# Altium schematic sheet DDR4.SchDoc: DDR4
size B; DocumentNumber: 2; SheetNumber: 2; SheetTotal: 46
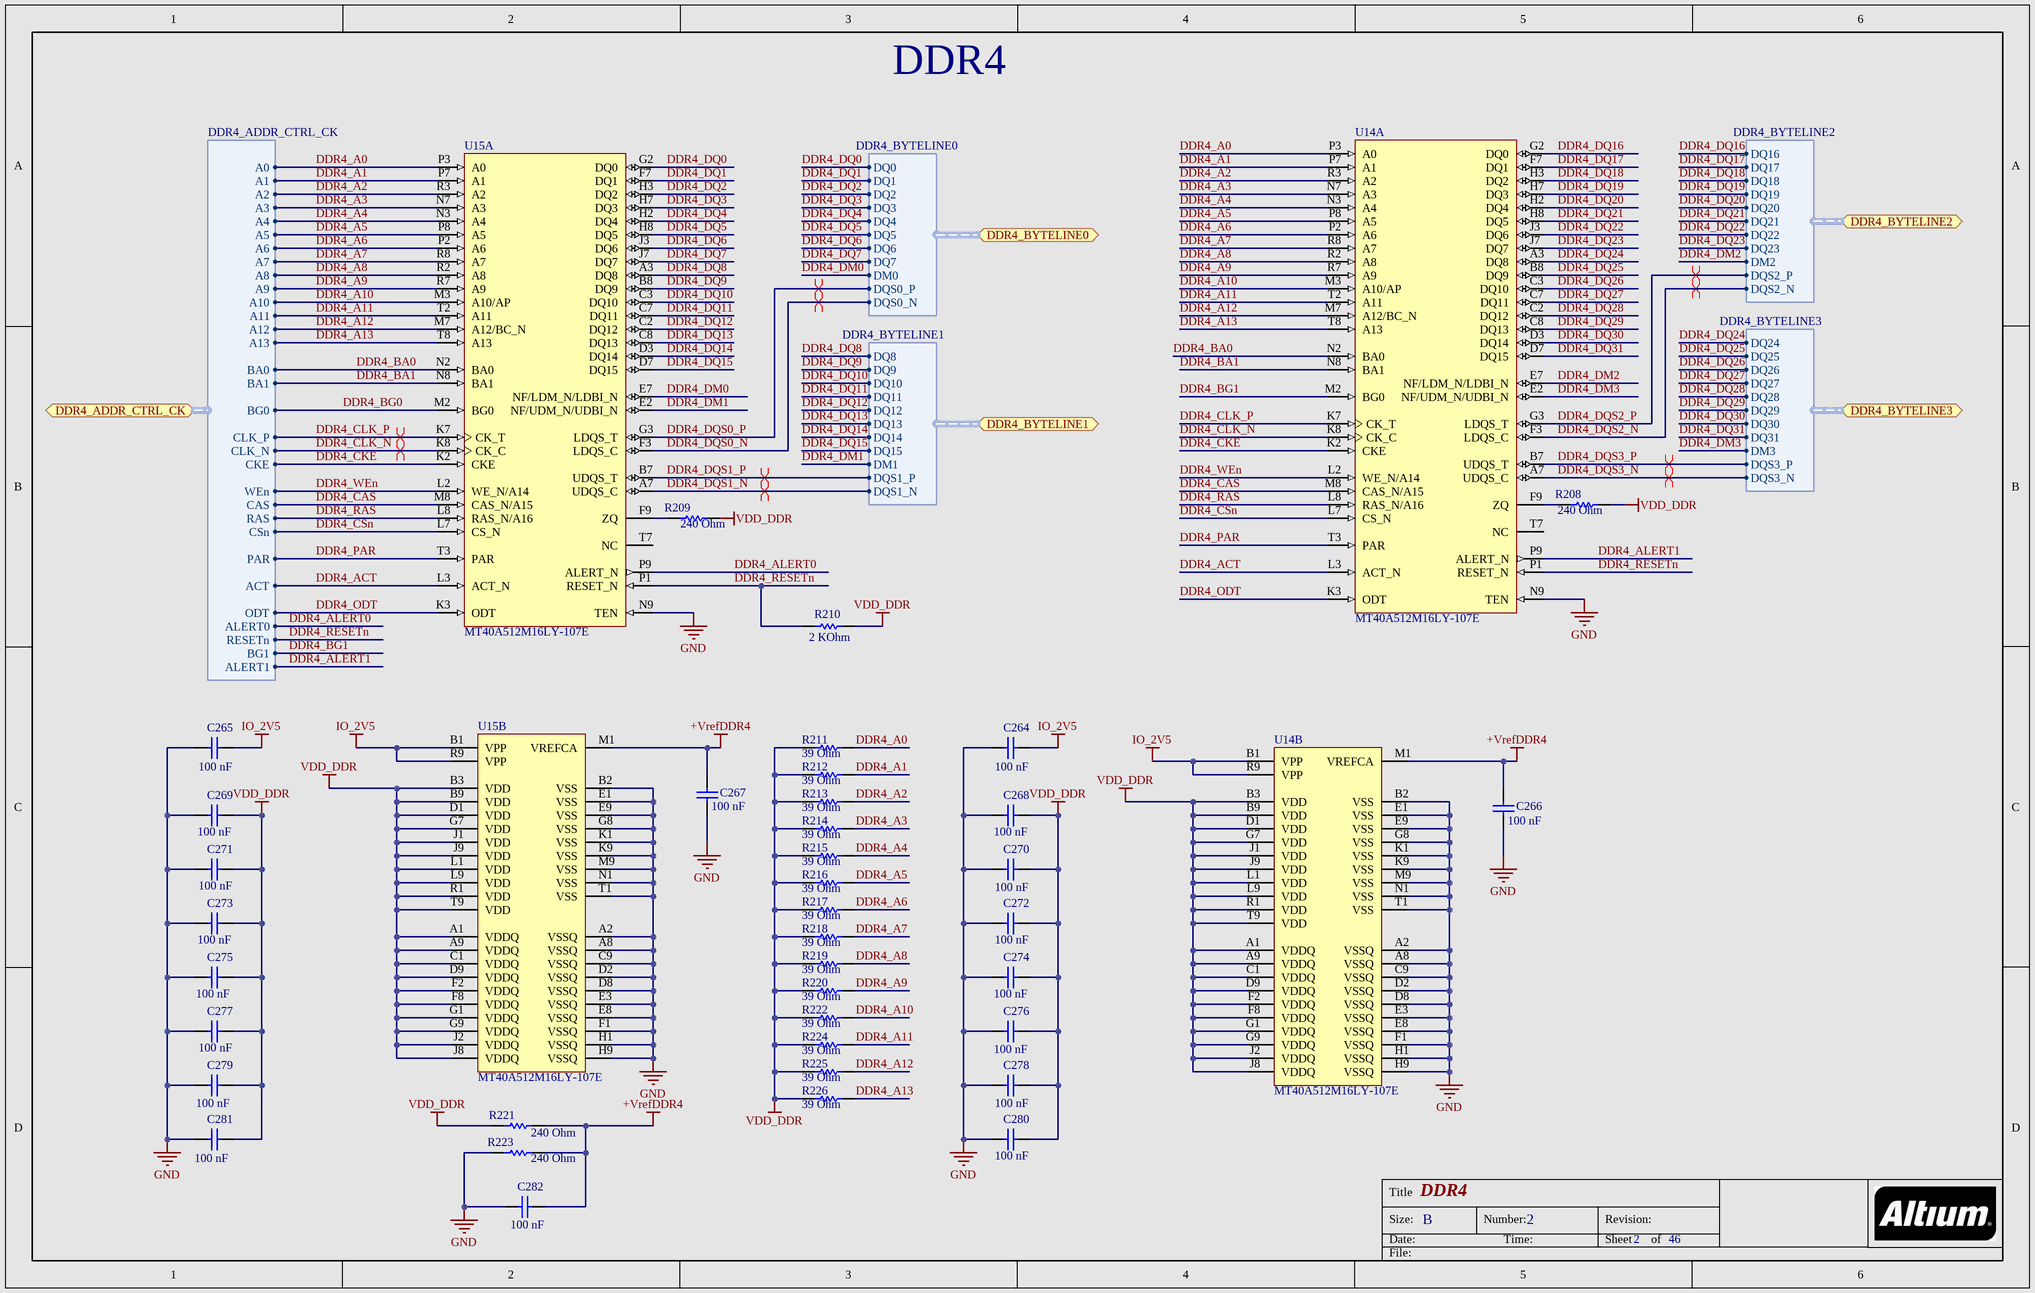
[diagram p0: DDR4.SchDoc]

## Parts
C264  Capacitance: 100 nF  [CAPC0603X33X15LL03T05]  (hidden comment: GRM033R60J104KE19D)
C265  Capacitance: 100 nF  [CAPC0603X33X15LL03T05]  (hidden comment: GRM033R60J104KE19D)
C266  Capacitance: 100 nF  [CAPC0603X33X15LL03T05]  (hidden comment: GRM033R60J104KE19D)
C267  Capacitance: 100 nF  [CAPC0603X33X15LL03T05]  (hidden comment: GRM033R60J104KE19D)
C268  Capacitance: 100 nF  [CAPC0603X33X15LL03T05]  (hidden comment: GRM033R60J104KE19D)
C269  Capacitance: 100 nF  [CAPC0603X33X15LL03T05]  (hidden comment: GRM033R60J104KE19D)
C270  Capacitance: 100 nF  [CAPC0603X33X15LL03T05]  (hidden comment: GRM033R60J104KE19D)
C271  Capacitance: 100 nF  [CAPC0603X33X15LL03T05]  (hidden comment: GRM033R60J104KE19D)
C272  Capacitance: 100 nF  [CAPC0603X33X15LL03T05]  (hidden comment: GRM033R60J104KE19D)
C273  Capacitance: 100 nF  [CAPC0603X33X15LL03T05]  (hidden comment: GRM033R60J104KE19D)
C274  Capacitance: 100 nF  [CAPC0603X33X15LL03T05]  (hidden comment: GRM033R60J104KE19D)
C275  Capacitance: 100 nF  [CAPC0603X33X15LL03T05]  (hidden comment: GRM033R60J104KE19D)
C276  Capacitance: 100 nF  [CAPC0603X33X15LL03T05]  (hidden comment: GRM033R60J104KE19D)
C277  Capacitance: 100 nF  [CAPC0603X33X15LL03T05]  (hidden comment: GRM033R60J104KE19D)
C278  Capacitance: 100 nF  [CAPC0603X33X15LL03T05]  (hidden comment: GRM033R60J104KE19D)
C279  Capacitance: 100 nF  [CAPC0603X33X15LL03T05]  (hidden comment: GRM033R60J104KE19D)
C280  Capacitance: 100 nF  [CAPC0603X33X15LL03T05]  (hidden comment: GRM033R60J104KE19D)
C281  Capacitance: 100 nF  [CAPC0603X33X15LL03T05]  (hidden comment: GRM033R60J104KE19D)
C282  Capacitance: 100 nF  [CAPC0603X33X15LL03T05]  (hidden comment: GRM033R60J104KE19D)
R208  Resistance: 240 Ohm  [RESC1005X40X25NL05T05]  (hidden comment: ERJ-2RKF2400X)
R209  Resistance: 240 Ohm  [RESC1005X40X25NL05T05]  (hidden comment: ERJ-2RKF2400X)
R210  Resistance: 2 KOhm  [RESC1005X40X25NL05T05]  (hidden comment: ERJ-2RKF2001X)
R211  Resistance: 39 Ohm  [RESC1005X40X25NL5T10]  (hidden comment: RC0402JR-0739RL)
R212  Resistance: 39 Ohm  [RESC1005X40X25NL5T10]  (hidden comment: RC0402JR-0739RL)
R213  Resistance: 39 Ohm  [RESC1005X40X25NL5T10]  (hidden comment: RC0402JR-0739RL)
R214  Resistance: 39 Ohm  [RESC1005X40X25NL5T10]  (hidden comment: RC0402JR-0739RL)
R215  Resistance: 39 Ohm  [RESC1005X40X25NL5T10]  (hidden comment: RC0402JR-0739RL)
R216  Resistance: 39 Ohm  [RESC1005X40X25NL5T10]  (hidden comment: RC0402JR-0739RL)
R217  Resistance: 39 Ohm  [RESC1005X40X25NL5T10]  (hidden comment: RC0402JR-0739RL)
R218  Resistance: 39 Ohm  [RESC1005X40X25NL5T10]  (hidden comment: RC0402JR-0739RL)
R219  Resistance: 39 Ohm  [RESC1005X40X25NL5T10]  (hidden comment: RC0402JR-0739RL)
R220  Resistance: 39 Ohm  [RESC1005X40X25NL5T10]  (hidden comment: RC0402JR-0739RL)
R221  Resistance: 240 Ohm  [RESC1005X40X25NL05T05]  (hidden comment: ERJ-2RKF2400X)
R222  Resistance: 39 Ohm  [RESC1005X40X25NL5T10]  (hidden comment: RC0402JR-0739RL)
R223  Resistance: 240 Ohm  [RESC1005X40X25NL05T05]  (hidden comment: ERJ-2RKF2400X)
R224  Resistance: 39 Ohm  [RESC1005X40X25NL5T10]  (hidden comment: RC0402JR-0739RL)
R225  Resistance: 39 Ohm  [RESC1005X40X25NL5T10]  (hidden comment: RC0402JR-0739RL)
R226  Resistance: 39 Ohm  [RESC1005X40X25NL5T10]  (hidden comment: RC0402JR-0739RL)
U14  MT40A512M16LY-107E  [MICT-LY-96_A]  (parts A,B of 2)
U15  MT40A512M16LY-107E  [MICT-LY-96_A]  (parts A,B of 2)

## Ports
DDR4_ADDR_CTRL_CK (harness DDR4_ADDR_CTRL_CK), DDR4_BYTELINE0 (harness DDR4_BYTELINE0), DDR4_BYTELINE1 (harness DDR4_BYTELINE1), DDR4_BYTELINE2 (harness DDR4_BYTELINE2), DDR4_BYTELINE3 (harness DDR4_BYTELINE3)

## Harnesses
DDR4_BYTELINE0: DQ0, DQ1, DQ2, DQ3, DQ4, DQ5, DQ6, DQ7, DM0, DQS0_P, DQS0_N
DDR4_BYTELINE1: DQ8, DQ9, DQ10, DQ11, DQ12, DQ13, DQ14, DQ15, DM1, DQS1_P, DQS1_N
DDR4_BYTELINE2: DQ16, DQ17, DQ18, DQ19, DQ20, DQ21, DQ22, DQ23, DM2, DQS2_P, DQS2_N
DDR4_BYTELINE3: DQ24, DQ25, DQ26, DQ27, DQ28, DQ29, DQ30, DQ31, DM3, DQS3_P, DQS3_N
DDR4_ADDR_CTRL_CK: A0, A1, A2, A3, A4, A5, A6, A7, A8, A9, A10, A11, A12, A13, BA0, BA1, BG0, CLK_P, CLK_N, CKE, WEn, CAS, RAS, CSn, PAR, ACT, ODT, ALERT0, RESETn, BG1, ALERT1

## Nets
+VrefDDR4: C266.2 C267.2 C282.2 R221.2 R223.2 U14.M1(VREFCA) U15.M1(VREFCA)
GND: C264.1 C265.1 C266.1 C267.1 C268.1 C269.1 C270.1 C271.1 C272.1 C273.1 C274.1 C275.1 C276.1 C277.1 C278.1 C279.1 C280.1 C281.1 C282.1 R223.1 U14.A2(VSSQ) U14.A8(VSSQ) U14.B2(VSS) U14.C9(VSSQ) U14.D2(VSSQ) U14.D8(VSSQ) U14.E1(VSS) U14.E3(VSSQ) U14.E8(VSSQ) U14.E9(VSS) U14.F1(VSSQ) U14.G8(VSS) U14.H1(VSSQ) U14.H9(VSSQ) U14.K1(VSS) U14.K9(VSS) U14.M9(VSS) U14.N1(VSS) U14.N9(TEN) U14.T1(VSS) U15.A2(VSSQ) U15.A8(VSSQ) U15.B2(VSS) U15.C9(VSSQ) U15.D2(VSSQ) U15.D8(VSSQ) U15.E1(VSS) U15.E3(VSSQ) U15.E8(VSSQ) U15.E9(VSS) U15.F1(VSSQ) U15.G8(VSS) U15.H1(VSSQ) U15.H9(VSSQ) U15.K1(VSS) U15.K9(VSS) U15.M9(VSS) U15.N1(VSS) U15.N9(TEN) U15.T1(VSS)
IO_2V5: C264.2 C265.2 U14.B1(VPP) U14.R9(VPP) U15.B1(VPP) U15.R9(VPP)
VDD_DDR: C268.2 C269.2 C270.2 C271.2 C272.2 C273.2 C274.2 C275.2 C276.2 C277.2 C278.2 C279.2 C280.2 C281.2 R208.2 R209.2 R210.2 R211.1 R212.1 R213.1 R214.1 R215.1 R216.1 R217.1 R218.1 R219.1 R220.1 R221.1 R222.1 R224.1 R225.1 R226.1 U14.A1(VDDQ) U14.A9(VDDQ) U14.B3(VDD) U14.B9(VDD) U14.C1(VDDQ) U14.D1(VDD) U14.D9(VDDQ) U14.F2(VDDQ) U14.F8(VDDQ) U14.G1(VDDQ) U14.G7(VDD) U14.G9(VDDQ) U14.J1(VDD) U14.J2(VDDQ) U14.J8(VDDQ) U14.J9(VDD) U14.L1(VDD) U14.L9(VDD) U14.R1(VDD) U14.T9(VDD) U15.A1(VDDQ) U15.A9(VDDQ) U15.B3(VDD) U15.B9(VDD) U15.C1(VDDQ) U15.D1(VDD) U15.D9(VDDQ) U15.F2(VDDQ) U15.F8(VDDQ) U15.G1(VDDQ) U15.G7(VDD) U15.G9(VDDQ) U15.J1(VDD) U15.J2(VDDQ) U15.J8(VDDQ) U15.J9(VDD) U15.L1(VDD) U15.L9(VDD) U15.R1(VDD) U15.T9(VDD)
DDR4_A0: R211.2 U14.P3(A0) U15.P3(A0) ; port DDR4_ADDR_CTRL_CK.A0
DDR4_A1: R212.2 U14.P7(A1) U15.P7(A1) ; port DDR4_ADDR_CTRL_CK.A1
DDR4_A2: R213.2 U14.R3(A2) U15.R3(A2) ; port DDR4_ADDR_CTRL_CK.A2
DDR4_A3: R214.2 U14.N7(A3) U15.N7(A3) ; port DDR4_ADDR_CTRL_CK.A3
DDR4_A4: R215.2 U14.N3(A4) U15.N3(A4) ; port DDR4_ADDR_CTRL_CK.A4
DDR4_A5: R216.2 U14.P8(A5) U15.P8(A5) ; port DDR4_ADDR_CTRL_CK.A5
DDR4_A6: R217.2 U14.P2(A6) U15.P2(A6) ; port DDR4_ADDR_CTRL_CK.A6
DDR4_A7: R218.2 U14.R8(A7) U15.R8(A7) ; port DDR4_ADDR_CTRL_CK.A7
DDR4_A8: R219.2 U14.R2(A8) U15.R2(A8) ; port DDR4_ADDR_CTRL_CK.A8
DDR4_A9: R220.2 U14.R7(A9) U15.R7(A9) ; port DDR4_ADDR_CTRL_CK.A9
DDR4_A10: R222.2 U14.M3(A10/AP) U15.M3(A10/AP) ; port DDR4_ADDR_CTRL_CK.A10
DDR4_A11: R224.2 U14.T2(A11) U15.T2(A11) ; port DDR4_ADDR_CTRL_CK.A11
DDR4_A12: R225.2 U14.M7(A12/BC_N) U15.M7(A12/BC_N) ; port DDR4_ADDR_CTRL_CK.A12
DDR4_A13: R226.2 U14.T8(A13) U15.T8(A13) ; port DDR4_ADDR_CTRL_CK.A13
DDR4_ACT: U14.L3(ACT_N) U15.L3(ACT_N) ; port DDR4_ADDR_CTRL_CK.ACT
DDR4_ALERT0: U15.P9(ALERT_N) ; port DDR4_ADDR_CTRL_CK.ALERT0
DDR4_ALERT1: U14.P9(ALERT_N) ; port DDR4_ADDR_CTRL_CK.ALERT1
DDR4_BA0: U14.N2(BA0) U15.N2(BA0) ; port DDR4_ADDR_CTRL_CK.BA0
DDR4_BA1: U14.N8(BA1) U15.N8(BA1) ; port DDR4_ADDR_CTRL_CK.BA1
DDR4_BG0: U15.M2(BG0) ; port DDR4_ADDR_CTRL_CK.BG0
DDR4_BG1: U14.M2(BG0) ; port DDR4_ADDR_CTRL_CK.BG1
DDR4_CAS: U14.M8(CAS_N/A15) U15.M8(CAS_N/A15) ; port DDR4_ADDR_CTRL_CK.CAS
DDR4_CKE: U14.K2(CKE) U15.K2(CKE) ; port DDR4_ADDR_CTRL_CK.CKE
DDR4_CLK_N: U14.K8(CK_C) U15.K8(CK_C) ; port DDR4_ADDR_CTRL_CK.CLK_N
DDR4_CLK_P: U14.K7(CK_T) U15.K7(CK_T) ; port DDR4_ADDR_CTRL_CK.CLK_P
DDR4_CSn: U14.L7(CS_N) U15.L7(CS_N) ; port DDR4_ADDR_CTRL_CK.CSn
DDR4_DM0: U15.E7(NF/LDM_N/LDBI_N) ; port DDR4_BYTELINE0.DM0
DDR4_DM1: U15.E2(NF/UDM_N/UDBI_N) ; port DDR4_BYTELINE1.DM1
DDR4_DM2: U14.E7(NF/LDM_N/LDBI_N) ; port DDR4_BYTELINE2.DM2
DDR4_DM3: U14.E2(NF/UDM_N/UDBI_N) ; port DDR4_BYTELINE3.DM3
DDR4_DQ0: U15.G2(DQ0) ; port DDR4_BYTELINE0.DQ0
DDR4_DQ1: U15.F7(DQ1) ; port DDR4_BYTELINE0.DQ1
DDR4_DQ2: U15.H3(DQ2) ; port DDR4_BYTELINE0.DQ2
DDR4_DQ3: U15.H7(DQ3) ; port DDR4_BYTELINE0.DQ3
DDR4_DQ4: U15.H2(DQ4) ; port DDR4_BYTELINE0.DQ4
DDR4_DQ5: U15.H8(DQ5) ; port DDR4_BYTELINE0.DQ5
DDR4_DQ6: U15.J3(DQ6) ; port DDR4_BYTELINE0.DQ6
DDR4_DQ7: U15.J7(DQ7) ; port DDR4_BYTELINE0.DQ7
DDR4_DQ8: U15.A3(DQ8) ; port DDR4_BYTELINE1.DQ8
DDR4_DQ9: U15.B8(DQ9) ; port DDR4_BYTELINE1.DQ9
DDR4_DQ10: U15.C3(DQ10) ; port DDR4_BYTELINE1.DQ10
DDR4_DQ11: U15.C7(DQ11) ; port DDR4_BYTELINE1.DQ11
DDR4_DQ12: U15.C2(DQ12) ; port DDR4_BYTELINE1.DQ12
DDR4_DQ13: U15.C8(DQ13) ; port DDR4_BYTELINE1.DQ13
DDR4_DQ14: U15.D3(DQ14) ; port DDR4_BYTELINE1.DQ14
DDR4_DQ15: U15.D7(DQ15) ; port DDR4_BYTELINE1.DQ15
DDR4_DQ16: U14.G2(DQ0) ; port DDR4_BYTELINE2.DQ16
DDR4_DQ17: U14.F7(DQ1) ; port DDR4_BYTELINE2.DQ17
DDR4_DQ18: U14.H3(DQ2) ; port DDR4_BYTELINE2.DQ18
DDR4_DQ19: U14.H7(DQ3) ; port DDR4_BYTELINE2.DQ19
DDR4_DQ20: U14.H2(DQ4) ; port DDR4_BYTELINE2.DQ20
DDR4_DQ21: U14.H8(DQ5) ; port DDR4_BYTELINE2.DQ21
DDR4_DQ22: U14.J3(DQ6) ; port DDR4_BYTELINE2.DQ22
DDR4_DQ23: U14.J7(DQ7) ; port DDR4_BYTELINE2.DQ23
DDR4_DQ24: U14.A3(DQ8) ; port DDR4_BYTELINE3.DQ24
DDR4_DQ25: U14.B8(DQ9) ; port DDR4_BYTELINE3.DQ25
DDR4_DQ26: U14.C3(DQ10) ; port DDR4_BYTELINE3.DQ26
DDR4_DQ27: U14.C7(DQ11) ; port DDR4_BYTELINE3.DQ27
DDR4_DQ28: U14.C2(DQ12) ; port DDR4_BYTELINE3.DQ28
DDR4_DQ29: U14.C8(DQ13) ; port DDR4_BYTELINE3.DQ29
DDR4_DQ30: U14.D3(DQ14) ; port DDR4_BYTELINE3.DQ30
DDR4_DQ31: U14.D7(DQ15) ; port DDR4_BYTELINE3.DQ31
DDR4_DQS0_N: U15.F3(LDQS_C) ; port DDR4_BYTELINE0.DQS0_N
DDR4_DQS0_P: U15.G3(LDQS_T) ; port DDR4_BYTELINE0.DQS0_P
DDR4_DQS1_N: U15.A7(UDQS_C) ; port DDR4_BYTELINE1.DQS1_N
DDR4_DQS1_P: U15.B7(UDQS_T) ; port DDR4_BYTELINE1.DQS1_P
DDR4_DQS2_N: U14.F3(LDQS_C) ; port DDR4_BYTELINE2.DQS2_N
DDR4_DQS2_P: U14.G3(LDQS_T) ; port DDR4_BYTELINE2.DQS2_P
DDR4_DQS3_N: U14.A7(UDQS_C) ; port DDR4_BYTELINE3.DQS3_N
DDR4_DQS3_P: U14.B7(UDQS_T) ; port DDR4_BYTELINE3.DQS3_P
DDR4_ODT: U14.K3(ODT) U15.K3(ODT) ; port DDR4_ADDR_CTRL_CK.ODT
DDR4_PAR: U14.T3(PAR) U15.T3(PAR) ; port DDR4_ADDR_CTRL_CK.PAR
DDR4_RAS: U14.L8(RAS_N/A16) U15.L8(RAS_N/A16) ; port DDR4_ADDR_CTRL_CK.RAS
DDR4_RESETn: R210.1 U14.P1(RESET_N) U15.P1(RESET_N) ; port DDR4_ADDR_CTRL_CK.RESETn
DDR4_WEn: U14.L2(WE_N/A14) U15.L2(WE_N/A14) ; port DDR4_ADDR_CTRL_CK.WEn
NetR208_1: R208.1 U14.F9(ZQ)
NetR209_1: R209.1 U15.F9(ZQ)

Not connected (* = marked no-connect by the designer): U14 T7(NC); U15 T7(NC)

## Layout directives
differential pair: DDR4_CLK_N, DDR4_CLK_P, DDR4_DQS0_N, DDR4_DQS0_P, DDR4_DQS1_N, DDR4_DQS1_P, DDR4_DQS2_N, DDR4_DQS2_P, DDR4_DQS3_N, DDR4_DQS3_P

## Notes on the sheet
- Title
- Size:
- Date:
- B
- Number:
- Time:
- Revision:
- Sheet
- of
- File:

## Library data of the parts
C264-C282 = CMP-2010-01652-4: Chip Capacitor, 100 nF, +/- 10%, 6.3 V, -55 to 85 degC, 0201 (0603 Metric), RoHS, Tape and Reel; Manufacturer: Basic Passives; Voltage Rating: 6.3 V; Type (Capacitors): X5R; Voltage Rating (DC): 3 V; Case\/Package: 0201; Min Operating Temperature: -55 degC; PartNumber: GRM033R60J104KE19D; Mounting Technology: Surface Mount; RoHSCompliant: true; Max Operating Temperature: 85 degC; Package Quantity: 15000; Packaging: Tape and Reel; Tolerance: 10%; Case Code (Imperial): 0201; Width: 0.3 mm; ComponentLink1URL: http://www.murata.com/; Case Code (Metric): 0603; ComponentLink1Description: Manufacturer URL; REACH SVHC: No SVHC; Height: 0.3 mm; Length: 0.6 mm; PackageDescription: 2-Pin Surface Mount Device, Body 0.6 x 0.3 mm; ComponentLink2Description: Datasheet; Pins: 2; PackageReference: 0201; Mount: Surface Mount; ComponentLink2URL: http://search.murata.co.jp/Ceramy/image/img/A01X/G101/ENG/GRM033R60J104KE19-01.pdf; DatasheetVersion: 03/2016; Radiation Hardening: No
R208 R209 R221 R223 = CMP-1665-00034-1: Chip Resistor, 240 Ohm, +/- 1%, 100 mW, -55 to 155 degC, 0402 (1005 Metric), RoHS, Tape and Reel; Power Rating: 100 mW; Voltage Rating: 50 V; Case\/Package: 0402; Packaging: Tape and Reel; Case Code (Imperial): 0402; Mount: Surface Mount; Min Operating Temperature: -55 degC; RoHSCompliant: true; Mounting Technology: Surface Mount; Tolerance: 1%; Max Operating Temperature: 155 degC; REACH SVHC: Unknown; Package Quantity: 10000; ComponentLink1URL: http://www.panasonic.com/; PartNumber: ERJ-2RKF2400X; ComponentLink1Description: Manufacturer URL; Height: 0.35 mm; PackageDescription: 2-Pin Surface Mount Device, Body 1 x 0.5 mm; Width: 0.5 mm; Length: 1 mm; Case Code (Metric): 1005; Radiation Hardening: No; ComponentLink2Description: Datasheet; ComponentLink2URL: http://industrial.panasonic.com/cdbs/www-data/pdf/RDA0000/AOA0000C86.pdf; PackageReference: 0402; DatasheetVersion: 04/2015; Pins: 2
R210 = CMP-2002-00758-3: Chip Resistor, 2 KOhm, +/- 1%, 100 mW, -55 to 155 degC, 0402 (1005 Metric), RoHS, Tape and Reel; Manufacturer: Basic Passives; Voltage Rating: 50 V; Power Rating: 100 mW; Case\/Package: 0402; Min Operating Temperature: -55 degC; Tolerance: 1%; REACH SVHC: Unknown; Case Code (Metric): 1005; PackageDescription: 2-Pin Surface Mount Device, Body 1 x 0.5 mm; RoHSCompliant: true; Packaging: Tape and Reel; Length: 1 mm; ComponentLink1Description: Manufacturer URL; Case Code (Imperial): 0402; Mounting Technology: Surface Mount; Package Quantity: 10000; Height: 0.35 mm; Width: 0.5 mm; Mount: Surface Mount; ComponentLink1URL: http://www.panasonic.com/; PartNumber: ERJ-2RKF2001X; Max Operating Temperature: 155 degC; PackageReference: 0402; DatasheetVersion: 04/2015; Pins: 2; Radiation Hardening: No; ComponentLink2Description: Datasheet; ComponentLink2URL: http://industrial.panasonic.com/cdbs/www-data/pdf/RDA0000/AOA0000C86.pdf
R211-R220 R222 R224-R226 = CMP-2002-07994-2: Chip Resistor, 39 Ohm, +/- 5%, 0.063 W, -55 to 155 degC, 0402 (1005 Metric), RoHS, Tape and Reel; Power Rating: 63 mW; Voltage Rating (DC): 50 V; Case Code (Imperial): 0402; Mount: Surface Mount; Max Operating Temperature: 155 degC; Case Code (Metric): 1005; ComponentLink1Description: Manufacturer URL; PackageDescription: 2-Pin Surface Mount Device, Body 1 x 0.5 mm; PartNumber: RC0402JR-0739RL; ComponentLink2Description: Datasheet; Tolerance: 5%; Height: 0.35 mm; Pins: 2; Min Operating Temperature: -55 degC; Length: 1 mm; DatasheetVersion: Rev. 4, 02/2016; ComponentLink2URL: http://www.yageo.com/documents/recent/PYu-RC_Group_51_RoHS_L_04.pdf; Mounting Technology: Surface Mount; Packaging: Cut Tape; Case/Package: 0402; Package Quantity: 1; RoHSCompliant: true; REACH SVHC: No SVHC; Width: 0.5 mm; Voltage Rating: 50 V; ComponentLink1URL: http://www.yageo.com/
U14 U15 = CMP-1718-00002-1: 8 Gb DDR4 SDRAM, 512 Meg x 16, 1.2 V, 0 to 95 degC, 96-Ball FBGA (LY), RoHS; Mounting Technology: Surface Mount; ComponentLink1URL: http://www.micron.com/; ComponentLink2Description: Datasheet; PartNumber: MT40A512M16LY-107E; DatasheetVersion: Rev. E, 05/2016; ComponentLink1Description: Manufacturer URL; ComponentLink2URL: https://www.micron.com/~/media/documents/products/data-sheet/dram/ddr4/8gb_ddr4_sdram.pdf; PackageDescription: 96-Ball Fine Pitch Ball Grid Array, Body 7.5 x 13.5 mm, Pitch 0.8 mm; PartId: 1